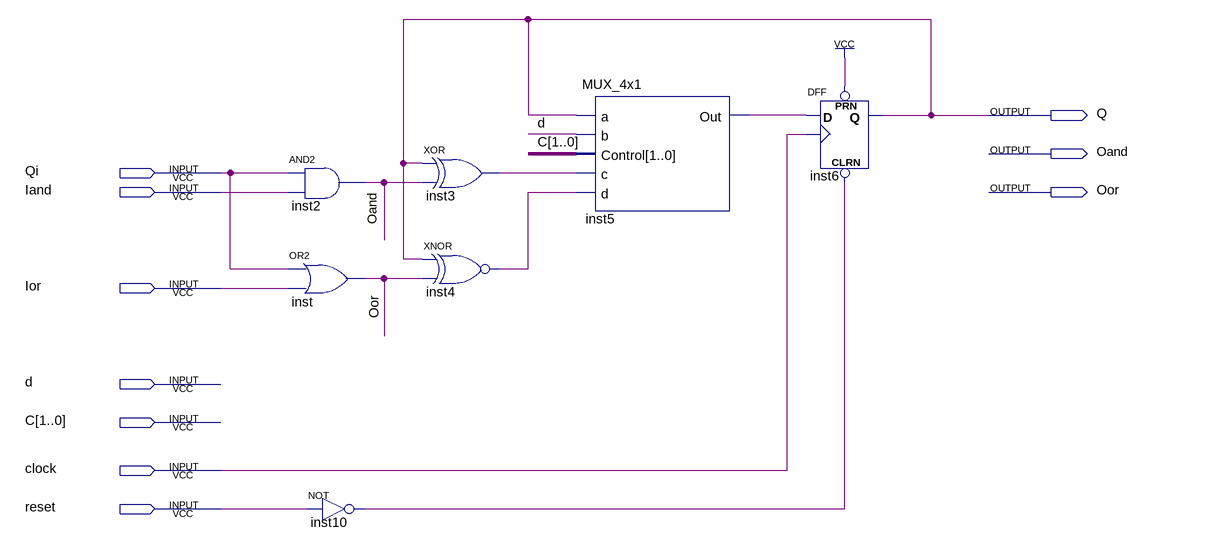
[diagram p0: schematic sheet]
// Quartus schematic S_PART.bdf as structural Verilog: 7 symbols, 10 pins
module S_PART (
  input  Qi,
  input  Iand,
  input  Ior,
  input  d,
  input  [1:0] C,
  input  clock,
  input  reset,
  output Q,
  output Oand,
  output Oor
);

  wire inst3_out, inst4_out, inst5_out, inst10_out;

  and inst2 (Oand, Qi, Iand);
  or inst (Oor, Qi, Ior);
  not inst10 (inst10_out, reset);
  xor inst3 (inst3_out, Q, Oand);
  xnor inst4 (inst4_out, Q, Oor);
  MUX_4x1 inst5 (.a(Q), .b(d), .Control(C), .c(inst3_out), .d(inst4_out), .Out(inst5_out));
  DFF inst6 (.CLRN(inst10_out), .CLK(clock), .D(inst5_out), .PRN(1'b1), .Q(Q));
endmodule
